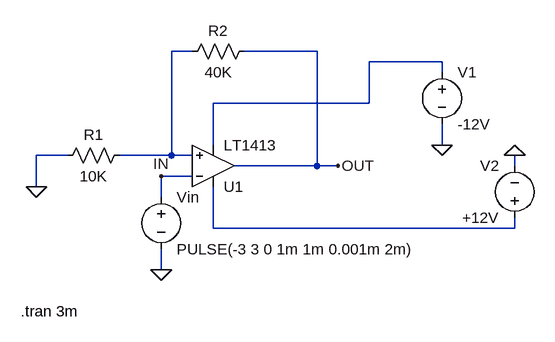
[diagram p0: schematic OPAMP_Bistable_Multivibrator.asc]
OPAMP_Bistable_Multivibrator.asc, the LTspice schematic file:
Version 4
SHEET 1 880 680
WIRE 160 -16 128 -16
WIRE 352 -16 240 -16
WIRE 544 0 432 0
WIRE 544 16 544 0
WIRE 432 64 432 0
WIRE 432 64 192 64
WIRE 192 128 192 64
WIRE 544 128 544 96
WIRE -32 144 -80 144
WIRE 128 144 128 -16
WIRE 128 144 48 144
WIRE 160 144 128 144
WIRE 352 160 352 -16
WIRE 352 160 224 160
WIRE 384 160 352 160
WIRE 656 160 656 144
WIRE 160 176 112 176
WIRE -80 192 -80 144
WIRE 112 208 112 176
WIRE 192 256 192 192
WIRE 656 256 656 240
WIRE 656 256 192 256
WIRE 112 320 112 288
FLAG -80 192 0
FLAG 112 320 0
FLAG 384 160 OUT
FLAG 112 176 IN
FLAG 544 128 0
FLAG 656 144 0
SYMBOL res 64 128 R90
WINDOW 0 0 56 VBottom 2
WINDOW 3 32 56 VTop 2
SYMATTR InstName R1
SYMATTR Value 10K
SYMBOL voltage 112 192 R0
WINDOW 123 0 0 Left 0
WINDOW 39 0 0 Left 0
SYMATTR InstName Vin
SYMATTR Value PULSE(-3 3 0 1m 1m 0.001m 2m)
SYMBOL res 256 -32 R90
WINDOW 0 0 56 VBottom 2
WINDOW 3 32 56 VTop 2
SYMATTR InstName R2
SYMATTR Value 40K
SYMBOL voltage 544 0 R0
SYMATTR InstName V1
SYMATTR Value -12V
SYMBOL voltage 656 256 R180
WINDOW 0 24 96 Left 2
WINDOW 3 24 16 Left 2
SYMATTR InstName V2
SYMATTR Value +12V
SYMBOL OpAmps\\LT1413 192 224 M180
SYMATTR InstName U1
TEXT -104 384 Left 2 !.tran 3m

The netlist it stands for:
* OPAMP_Bistable_Multivibrator.asc
R1 N001 0 10K
Vin IN 0 PULSE(-3 3 0 1m 1m 0.001m 2m)
R2 OUT N001 40K
V1 N002 0 -12V
V2 N003 0 +12V
XU1 N001 IN N003 N002 OUT LT1413  ; pins In+ In- V+ V- OUT
.tran 3m
.lib LTC.lib
.backanno
.end